# Altium project SolderingStation_V4.PrjPcb
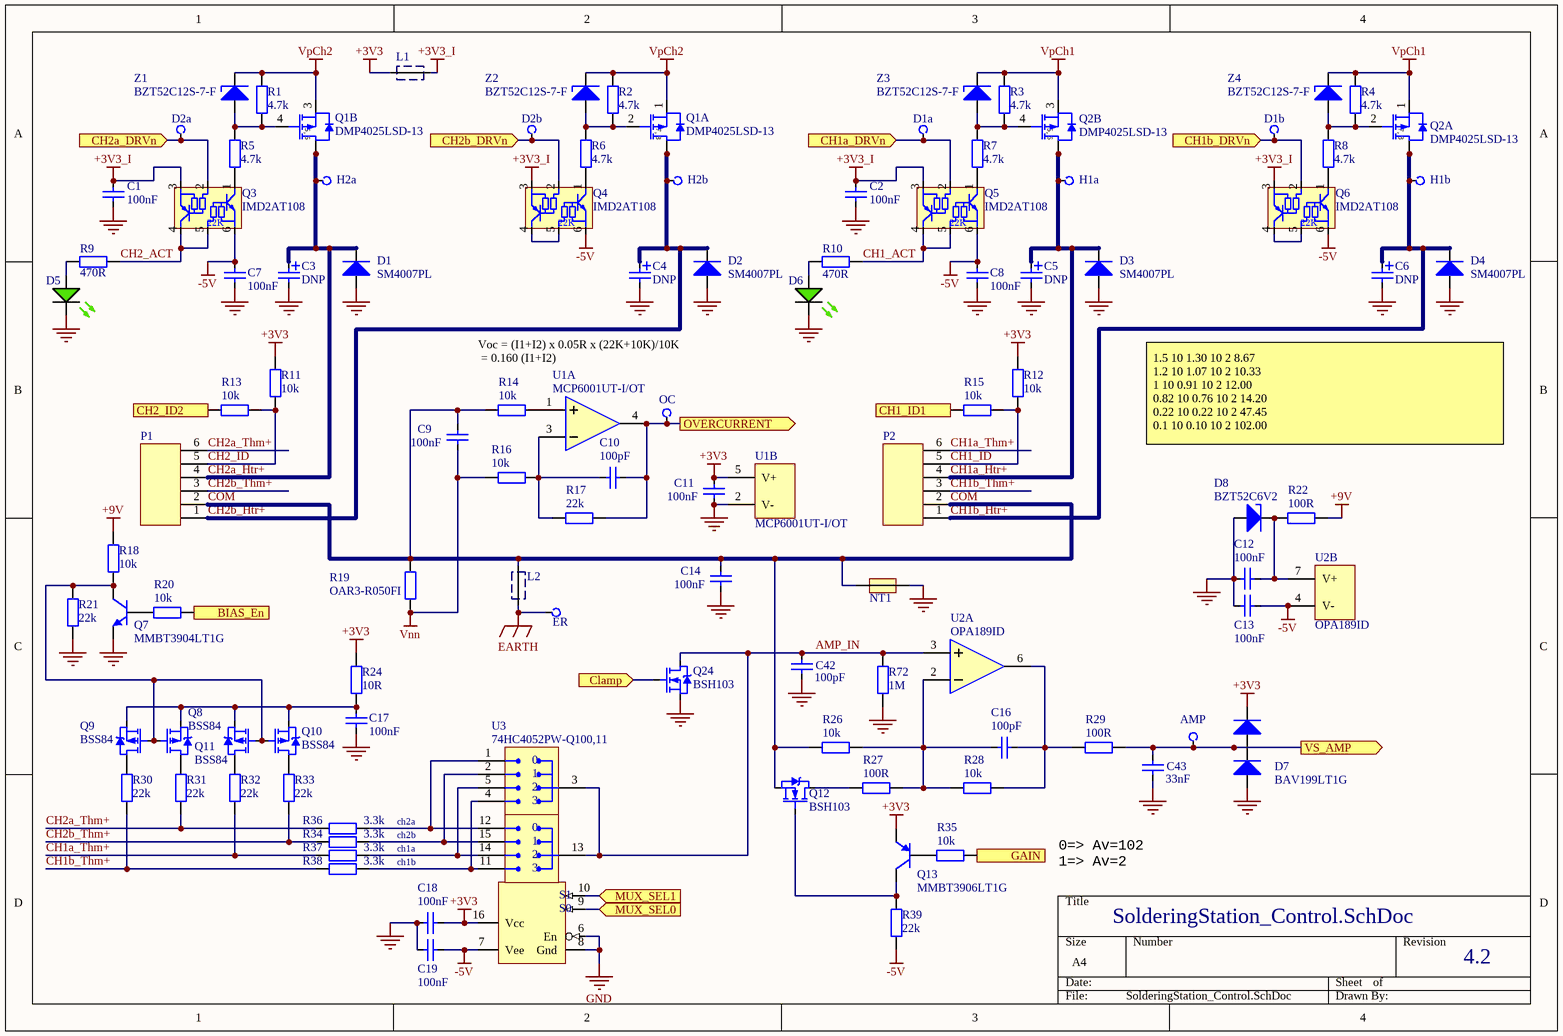
[diagram p0: SolderingStation_Control.SchDoc]
Version: 4.2
3 sheets, 227 parts. Net scope: flat (ports and power ports of the same name join across sheets).
Board file: SolderingStation.PcbDoc
Sheets:
  SolderingStation_Control.SchDoc
  SolderingStation_Power.SchDoc
  SolderingStation_Processor.SchDoc

## Sheet SolderingStation_Control.SchDoc
size A4

### Parts
AMP  NTC1  [PCBPIN - 0.9mm]  (value not drawn)  (no BOM)
C1  100nF  [CCNP1608-0603_N]
C2  100nF  [CCNP1608-0603_N]
C3  DNP  [CC2012-0805]  (no BOM)
C4  DNP  [CC2012-0805]  (no BOM)
C5  DNP  [CC2012-0805]  (no BOM)
C6  DNP  [CC2012-0805]  (no BOM)
C7  100nF  [CCNP1608-0603_N]
C8  100nF  [CCNP1608-0603_N]
C9  100nF  [CCNP1608-0603_N]
C10  100pF  [CCNP1608-0603_N]
C11  100nF  [CCNP1608-0603_N]
C12  100nF  [CCNP1608-0603_N]
C13  100nF  [CCNP1608-0603_N]
C14  100nF  [CCNP1608-0603_N]
C16  100pF  [CCNP1608-0603_N]
C17  100nF  [CCNP1608-0603_N]
C18  100nF  [CCNP1608-0603_N]
C19  100nF  [CCNP1608-0603_N]
C42  100pF  [CCNP1608-0603_N]
C43  33nF  [CCNP1608-0603_N]
D1  SM4007PL  [SOD-123FL]
D1a  Drive1  [PCBPIN - 0.9mm]  (value not drawn)  (no BOM)
D1b  Drive2  [PCBPIN - 0.9mm]  (value not drawn)  (no BOM)
D2  SM4007PL  [SOD-123FL]
D2a  Drive2  [PCBPIN - 0.9mm]  (value not drawn)  (no BOM)
D2b  Drive2  [PCBPIN - 0.9mm]  (value not drawn)  (no BOM)
D3  SM4007PL  [SOD-123FL]
D4  SM4007PL  [SOD-123FL]
D5  LED  [LED3MM-GREEN - 10mm Proud]  (value not drawn)
D6  LED  [LED3MM-GREEN - 10mm Proud]  (value not drawn)
D7  BAV199LT1G  [SOT23_N]
D8  BZT52C6V2  [SOD-123]
ER  Gnd  [PCBPIN - 0.9mm]  (value not drawn)  (no BOM)
H1a  Heater1  [PCBPIN - 0.9mm]  (value not drawn)  (no BOM)
H1b  Heater2  [PCBPIN - 0.9mm]  (value not drawn)  (no BOM)
H2a  Heater2  [PCBPIN - 0.9mm]  (value not drawn)  (no BOM)
H2b  Heater2  [PCBPIN - 0.9mm]  (value not drawn)  (no BOM)
L1  Ferrite Bead 600R@100MHz  [FB2012-0805]  (value not drawn)
L2  Ferrite Bead 600R@100MHz  [FB2012-0805]  (value not drawn)
NT1  NetTieVia  [NetTieVia]  (value not drawn)  (net tie, no BOM)
OC  Overcurrent  [PCBPIN - 0.9mm]  (value not drawn)  (no BOM)
P1  MOLEX-43045-0612  [MOLEX-43045-0612]  (value not drawn)
P2  MOLEX-43045-0612  [MOLEX-43045-0612]  (value not drawn)
Q1  DMP4025LSD-13  [SO-8_M]  (parts A,B of 2)
Q2  DMP4025LSD-13  [SO-8_M]  (parts A,B of 2)
Q3  IMD2AT108  [SOT457_M - MIRROR]
Q4  IMD2AT108  [SOT457_M - MIRROR]
Q5  IMD2AT108  [SOT457_M - MIRROR]
Q6  IMD2AT108  [SOT457_M - MIRROR]
Q7  MMBT3904LT1G  [SOT23_N]
Q8  BSS84  [SOT23_M]
Q9  BSS84  [SOT23_M]
Q10  BSS84  [SOT23_M]
Q11  BSS84  [SOT23_M]
Q12  BSH103  [SOT23_N]
Q13  MMBT3906LT1G  [SOT23_N]
Q24  BSH103  [SOT23_N]
R1  4.7k  [CR1608-0603_N]
R2  4.7k  [CR1608-0603_N]
R3  4.7k  [CR1608-0603_N]
R4  4.7k  [CR1608-0603_N]
R5  4.7k  [CR1608-0603_N]
R6  4.7k  [CR1608-0603_N]
R7  4.7k  [CR1608-0603_N]
R8  4.7k  [CR1608-0603_N]
R9  470R  [CR1608-0603_N]
R10  470R  [CR1608-0603_N]
R11  10k  [CR1608-0603_N]
R12  10k  [CR1608-0603_N]
R13  10k  [CR1608-0603_N]
R14  10k  [CR1608-0603_N]
R15  10k  [CR1608-0603_N]
R16  10k  [CR1608-0603_N]
R17  22k  [CR1608-0603_N]
R18  10k  [CR1608-0603_N]
R19  OAR3-R050FI  [OAR3-R050FI]
R20  10k  [CR1608-0603_N]
R21  22k  [CR1608-0603_N]
R22  100R  [CR1608-0603_N]
R24  10R  [CR1608-0603_N]
R26  10k  [CR1608-0603_N]
R27  100R  [CR1608-0603_N]
R28  10k  [CR1608-0603_N]
R29  100R  [CR1608-0603_N]
R30  22k  [CR1608-0603_N]
R31  22k  [CR1608-0603_N]
R32  22k  [CR1608-0603_N]
R33  22k  [CR1608-0603_N]
R34  3.3k  [CR1608-0603_N]
R35  10k  [CR1608-0603_N]
R36  3.3k  [CR1608-0603_N]
R37  3.3k  [CR1608-0603_N]
R38  3.3k  [CR1608-0603_N]
R39  22k  [CR1608-0603_N]
R72  1M  [CR1608-0603_N]
U1  MCP6001UT-I/OT  [SOT23-5_M]  (parts A,B of 2)
U2  OPA189ID  [SOIC127P600-8N]  (parts A,B of 2)
U3  74HC4052PW-Q100,11  [TSSOP16_M]
Z1  BZT52C12S-7-F  [SOD-323]
Z2  BZT52C12S-7-F  [SOD-323]
Z3  BZT52C12S-7-F  [SOD-323]
Z4  BZT52C12S-7-F  [SOD-323]

### Ports
BIAS_En (in), CH1_ID1 (out), CH1a_DRVn (in), CH1b_DRVn (in), CH2_ID2 (out), CH2a_DRVn (in), CH2b_DRVn (in), Clamp (in), GAIN (in), MUX_SEL0 (in), MUX_SEL1 (in), OVERCURRENT (out), VS_AMP (out)

### Nets
+3V3: C11.1 C18.1 D7.2(A2) L1.1 Q13.2(E) R11.2 R12.2 R24.1 U1.5(V+) U3.16(Vcc)
+3V3_I: C1.1 C2.1 L1.2 Q3.3(E2) Q4.3(E2) Q5.3(E2) Q6.3(E2)
+9V: R18.1 R22.1
-5V: C7.1 C8.1 C13.1 C19.1 Q3.6(E1) Q4.6(E1) Q5.6(E1) Q6.6(E1) R39.1 U2.4(V-) U3.7(Vee)
EARTH: ER.1(TP) L2.1
GND: C1.2 C2.2 C3.2 C4.2 C5.2 C6.2 C7.2 C8.2 C11.2 C12.2 C13.2 C14.2 C17.1 C18.2 C19.2 C42.1 C43.1 D1.A D2.A D3.A D4.A D5.K D6.K D7.1(A1) D8.A NT1.1 Q7.2(E) Q24.2(S) R21.1 R72.1 U1.2(V-) U3.6(En) U3.8(Gnd)
Vnn: C9.2 R16.2 R19.1
VpCh1: Q2.1(S1) Q2.3(S2) R3.2 R4.2 Z3.K Z4.K
VpCh2: Q1.1(S1) Q1.3(S2) R1.2 R2.2 Z1.K Z2.K
AMP_IN: C42.2 Q24.3(D) R72.2 U2.3(+IN) U3.3(2Z) U3.13(1Z)
BIAS_En: R20.2 ; port BIAS_En
CH1_ACT: Q5.4(C2) Q5.5(B1) R10.2
CH1_ID: P2.5 R12.1 R15.1
CH1_ID1: R15.2 ; port CH1_ID1
CH1a_DRVn: D1a.1(TP) Q5.2(B2) ; port CH1a_DRVn
CH1a_Htr+: C5.1 D3.K H1a.1(TP) P2.4 Q2.5(D2) Q2.6(D2)
CH1a_Thm+: P2.6 R32.1 R37.2
CH1b_DRVn: D1b.1(TP) Q6.2(B2) ; port CH1b_DRVn
CH1b_Htr+: C6.1 D4.K H1b.1(TP) P2.1 Q2.7(D1) Q2.8(D1)
CH1b_Thm+: P2.3 R30.1 R38.2
CH2_ACT: Q3.4(C2) Q3.5(B1) R9.2
CH2_ID: P1.5 R11.1 R13.1
CH2_ID2: R13.2 ; port CH2_ID2
CH2a_DRVn: D2a.1(TP) Q3.2(B2) ; port CH2a_DRVn
CH2a_Htr+: C3.1 D1.K H2a.1(TP) P1.4 Q1.5(D2) Q1.6(D2)
CH2a_Thm+: P1.6 R31.1 R36.2
CH2b_DRVn: D2b.1(TP) Q4.2(B2) ; port CH2b_DRVn
CH2b_Htr+: C4.1 D2.K H2b.1(TP) P1.1 Q1.7(D1) Q1.8(D1)
CH2b_Thm+: P1.3 R33.1 R34.2
Clamp: Q24.1(G) ; port Clamp
COM: C9.1 C14.1 L2.2 NT1.2 P1.2 P2.2 Q12.2(S) R14.2 R19.2 R26.1
GAIN: R35.2 ; port GAIN
MUX_SEL0: U3.9(S1) ; port MUX_SEL0
MUX_SEL1: U3.10(S0) ; port MUX_SEL1
OVERCURRENT: C10.2 OC.1(TP) R17.2 U1.4(Out) ; port OVERCURRENT
VS_AMP: AMP.1(TP) C43.2 D7.3(K) R29.1 ; port VS_AMP
NetC10_1: C10.1 R16.1 R17.1 U1.3(In-)
NetC12_1: C12.1 D8.K R22.2 U2.7(V+)
NetC16_1: C16.1 R26.2 R27.1 R28.1 U2.2(-IN)
NetC16_2: C16.2 R28.2 R29.2 U2.6(OUT)
NetC17_2: C17.2 Q8.2(S) Q9.2(S) Q10.2(S) Q11.2(S) R24.2
NetD5_A: D5.A R9.1
NetD6_A: D6.A R10.1
NetQ1_2: Q1.2(G1) R2.1 R6.2 Z2.A
NetQ1_4: Q1.4(G2) R1.1 R5.2 Z1.A
NetQ2_2: Q2.2(G1) R4.1 R8.2 Z4.A
NetQ2_4: Q2.4(G2) R3.1 R7.2 Z3.A
NetQ3_1: Q3.1(C1) R5.1
NetQ4_1: Q4.1(C1) R6.1
NetQ4_4: Q4.4(C2) Q4.5(B1)
NetQ5_1: Q5.1(C1) R7.1
NetQ6_1: Q6.1(C1) R8.1
NetQ6_4: Q6.4(C2) Q6.5(B1)
NetQ7_1: Q7.1(B) R20.1
NetQ7_3: Q7.3(C) Q8.1(G) Q9.1(G) Q10.1(G) Q11.1(G) R18.2 R21.2
NetQ8_3: Q8.3(D) R32.2
NetQ9_3: Q9.3(D) R30.2
NetQ10_3: Q10.3(D) R33.2
NetQ11_3: Q11.3(D) R31.2
NetQ12_1: Q12.1(G) Q13.3(C) R39.2
NetQ12_3: Q12.3(D) R27.2
NetQ13_1: Q13.1(B) R35.1
NetR14_1: R14.1 U1.1(In+)
NetR34_1: R34.1 U3.2(2Y2) U3.15(1Y2)
NetR36_1: R36.1 U3.1(2Y0) U3.12(1Y0)
NetR37_1: R37.1 U3.5(2Y1) U3.14(1Y1)
NetR38_1: R38.1 U3.4(2Y3) U3.11(1Y3)

### Notes on the sheet
- Voc = (I1+I2) x 0.05R x (22K+10K)/10K
  = 0.160 (I1+I2)
- 1.5	10	1.30	10	2	8.67
  1.2	10	1.07	10	2	10.33
  1	10	0.91	10	2	12.00
  0.82	10	0.76	10	2	14.20
  0.22	10	0.22	10	2	47.45
  0.1	10	0.10	10	2	102.00
- ch1a
- ch2a
- ch2b
- ch1b
- 0=> Av=102
  1=> Av=2
- (in symbol 74HC4052PW-Q100,11) 0
- (in symbol DMP4025LSD-13, part A) 7, 8
- (in symbol DMP4025LSD-13, part B) 5, 6
- (in symbol IMD2AT108) 22K

### Library data of the parts
AMP D1a D1b D2a D2b ER H1a H1b H2a H2b OC = TP: Test Point; Digikey: *; Farnell PN: *; LCSC: *
C1 C2 C7-C9 C11-C14 C17-C19 = Cap_CCNP_0603_100nF: Capacitor non-polar SMT 0603; Manufacturer: Generic Components; Class: Passive; Published: 08/06/2000; Publisher: Altium Hobart Technology Centre; SubClass: Capacitor; Farnell PN: *; Digikey: *; Value: 100nF; LCSC: C14663
C3-C6 = Cap_CC_0805: Capacitor SMT 0805; Manufacturer: Generic Components; Class: Passive; Published: 08/06/2000; Publisher: Altium Hobart Technology Centre; SubClass: Capacitor; Farnell PN: *; Digikey: *; Value: DNP
C10 C16 C42 C43 = Cap_CCNP_0603_100pF: Capacitor non-polar SMT 0603; Manufacturer: Generic Components; Class: Passive; Published: 08/06/2000; Publisher: Altium Hobart Technology Centre; SubClass: Capacitor; Farnell PN: *; Digikey: *
  C10 C16 C42: Value: 100pF; LCSC: C14858
  C43: Value: 33nF; LCSC: C21117
D1-D4 = SM4007PL: Diodes - General Purpose, 1kV 1A 1.1V 1A SOD-123FL; Class: Discrete; SubClass: Diode - Switching; Digikey: *; Farnell PN: *; LCSC: C64898
D5 D6 = LED_3MM_GREEN: 3mm Green LED; Manufacturer: Generic Components; Class I: Optoelectronic; Published: 8-Jun-2000; Revision: July-2002: Re-released for DXP Platform.; Publisher: Altium Limited; Class II: LED; Digikey: *; Farnell PN: *; LCSC: *
D7 = BAV199LT1G: Diode - Dual Series low-leakage switching, SOT-23; Digikey: BAV199LT1GOSCT-ND; Farnell PN: 1431115; LCSC: C145516
D8 = BZT52C6V2: Zener Single Diode, 6.2 V, 500 mW, SOD-123, 6 %, 2 Pins, 150 °C; Manufacturer: DiodesIncorporated; Unit Weight: 0.000353oz; Zz - Zener Impedance: 60Ohms; Vz - Zener Voltage: 5.1V; Pd - Power Dissipation: 500mW; Zener Current: 5mA; Ir - Reverse Current: 2uA; Voltage Temperature Coefficient: -0.75mV/C; Voltage Tolerance: 6%; Height: 1.35mm; Width: 1.7mm; Minimum Operating Temperature: -65C; Series: BZT52C5; Package Description: 2-Pin Surface Mount Device, Body 2.7 x 1.55 mm; Length: 2.85mm; Mounting Technology: SurfaceMount; Brand: DiodesIncorporated; Factory Pack Quantity: 3000; Product Category: ZenerDiodes; RoHS: True; Manufacturer URL: http://www.diodes.com/; Termination Style: SMD/SMT; Package / Case: SOD-123; Packaging: Reel; Package Reference: SOD123; Datasheet Version: Rev. 37-2, 09/2012; Maximum Operating Temperature: +150C; Datasheet URL: http://www.diodes.com/_files/datasheets/ds18004.pdf; Configuration: Single; Mounting Style: SMD/SMT
L1 L2 = Ferrite Bead 0805 600R: Ferrite Bead 600Ω @ 100MHz 1 500mA 300mΩ 0805; Farnell PN: *; Digikey: *; LCSC: C1017
P1 P2 = MOLEX-43045-0612: Wire-To-Board Connector, With Polarizing Peg, 3 mm, 6 Contacts, Header, Micro-Fit 3.0 43045 Series; Farnell PN: 1012248
Q1 Q2 = DMP4025LSD-13: P-Channel dual MOSFET, 40 V, 7.6 A, 0.018 ohm, SOIC, Surface Mount; Farnell: 2543521
Q3-Q6 = IMD2AT108: Pre-Biased NPN and PNP pair, 50 V, 100 mA, 22 kohm, 22 kohm; LCSC: C509889; Farnell PN: 1680329
Q7 = MMBT3904LT1G: General Purpose Transistor, NPN Silicon, 3-Pin SOT-23, Pb-Free, Tape and Reel; Manufacturer: On Semiconductor; IC Continuous (A): 0.2; fT Min (MHz): 300; ComponentLink2Description: Datasheet; Polarity: NPN; PackageDescription: 3-Pin Small Outline Transistor, Body 2.92 x 1.3 mm, Pitch 0.95 mm; ComponentLink2URL: http://www.onsemi.cn/pub_link/Collateral/MMBT3904LT1-D.PDF; DatasheetVersion: Rev. 12; Mounting Technology: Surface Mount; PartNumber: MMBT3904LT1G; ComponentLink1URL: http://www.onsemi.com/; ComponentLink3Description: Package Specification; ComponentLink1Description: Manufacturer URL; PackageVersion: Rev. AP, 11/2009; PackageReference: SOT-23-3-318-08; Packing: Tape and Reel; ComponentLink3URL: http://www.onsemi.cn/pub_link/Collateral/318-08.PDF; RoHS: TRUE; LCSC: C20526
Q8-Q11 = BSS84: P-Channel Enhancement Mode FET -0.13 A, -50 V,  RDS(ON) = 10R at VGS = -5 V; Digikey: *; Farnell PN: *; LCSC: C8492
Q12 Q24 = BSH103: N-channel enhancement mode FET, , 30 V, 850 mA, 0.4 ohm, SOT23; PackageDescription: SOT-23; 3 Leads; Body 3.1 x 2.5 mm, inc. leads (LxW max), Alternate Lead Configuration; ComponentLink1Description: Manufacturer Link; ComponentLink1URL: http://www.zetex.com/; ComponentLink2Description: Datasheet; ComponentLink2URL: www.zetex.com/3.0/pdf/BSS138.pdf; Farnell PN: 1081307; Digikey: *; LCSC: C88711
Q13 = MMBT3906LT1G: General Purpose Transistor, PNP Silicon, 3-Pin SOT-23, Pb-Free, Tape and Reel; Manufacturer: On Semiconductor; IC Continuous (A): -0.2; fT Min (MHz): 250; PackageDescription: 3-Pin Small Outline Transistor, Body 2.92 x 1.3 mm, Pitch 0.95 mm; PartNumber: MMBT3906LT1G; Packing: Tape and Reel; ComponentLink3Description: Package Specification; Mounting Technology: Surface Mount; ComponentLink3URL: http://www.onsemi.cn/pub_link/Collateral/318-08.PDF; ComponentLink1URL: http://www.onsemi.com/; ComponentLink2URL: http://www.onsemi.cn/pub_link/Collateral/MMBT3906LT1-D.PDF; PackageReference: SOT-23-3-318-08; Polarity: PNP; ComponentLink2Description: Datasheet; PackageVersion: Rev. AP, 11/2009; RoHS: TRUE; DatasheetVersion: Rev. 11; ComponentLink1Description: Manufacturer URL; LCSC: C53444
R1-R8 = Res_CR0603_4k7: Resistor SMT 0603; Manufacturer: Generic Components; Class: Passive; Published: 08/06/2000; Publisher: Altium Hobart Technology Centre; SubClass: Resistor; Farnell PN: *; Digikey: *; LCSC: C23162; Value: 4.7k
R9 R10 = Res_CR0603_470R: Resistor SMT 0603; Manufacturer: Generic Components; Class: Passive; Published: 08/06/2000; Publisher: Altium Hobart Technology Centre; SubClass: Resistor; Farnell PN: *; Digikey: *; Value: 470R; LCSC: C23179
R11-R16 R18 R20 R26 R28 R35 = Res_CR0603_10k: Resistor SMT 0603; Manufacturer: Generic Components; Class: Passive; Published: 08/06/2000; Publisher: Altium Hobart Technology Centre; SubClass: Resistor; Farnell PN: *; Digikey: *; LCSC: C25804; Value: 10k
R17 R21 R30-R33 R39 = Res_CR0603_22k: Resistor SMT 0603; Manufacturer: Generic Components; Class: Passive; Published: 08/06/2000; Publisher: Altium Hobart Technology Centre; SubClass: Resistor; Farnell PN: *; Digikey: *; LCSC: C31850; Value: 22k
R19 = OAR3-R050FI: Current Sense Resistor, 0.05 ohm, OAR Series, 3 W, Metal Strip, Radial Leaded, 1%
R22 R29 = Res_CR0603_0R: Resistor SMT 0603; Manufacturer: Generic Components; Class: Passive; Published: 08/06/2000; Publisher: Altium Hobart Technology Centre; SubClass: Resistor; Farnell PN: *; Digikey: *; LCSC: C22775; Value: 100R
R24 = Res_CR0603_10R: Resistor SMT 0603; Manufacturer: Generic Components; Class: Passive; Published: 08/06/2000; Publisher: Altium Hobart Technology Centre; SubClass: Resistor; Farnell PN: *; Digikey: *; Value: 10R; LCSC: C22859
R27 R34 R36-R38 = Res_CR0603_3k3: Resistor SMT 0603; Manufacturer: Generic Components; Class: Passive; Published: 08/06/2000; Publisher: Altium Hobart Technology Centre; SubClass: Resistor; Farnell PN: *; Digikey: *
  R27: LCSC: C22775; Value: 100R
  R34 R36-R38: LCSC: C22978; Value: 3.3k
R72 = Res_CR0603_1M: Resistor SMT 0603; Manufacturer: Generic Components; Class: Passive; Published: 08/06/2000; Publisher: Altium Hobart Technology Centre; SubClass: Resistor; Farnell PN: *; Digikey: *; LCSC: C22935; Value: 1M
U1 = MCP6001UT-I/OT: Op-Amp, Single supply R-R in/out; Digikey: *; Farnell PN: *; LCSC: C21403
U2 = OPA189ID: Op-Amp 14MHz, MUX-friendly, low-noise, Zero-Drift, RRO, CMOS precision
U3 = 74HC4052PW-Q100,11: Analog Multiplexer / Demultiplexer, 4:1, 2 Circuits, 225 ohm, 2V to 10V, TSSOP-16; Farnell PN: 2445305; LCSC: C547006
Z1-Z4 = BZT52C12S-7-F: Surface Mount Zener Diode, 12-13 V, -65 to 150 degC, SOD-123; LCSC: C124208
NT1 = NetTieVia: LCSC: *

## Sheet SolderingStation_Power.SchDoc
size A4
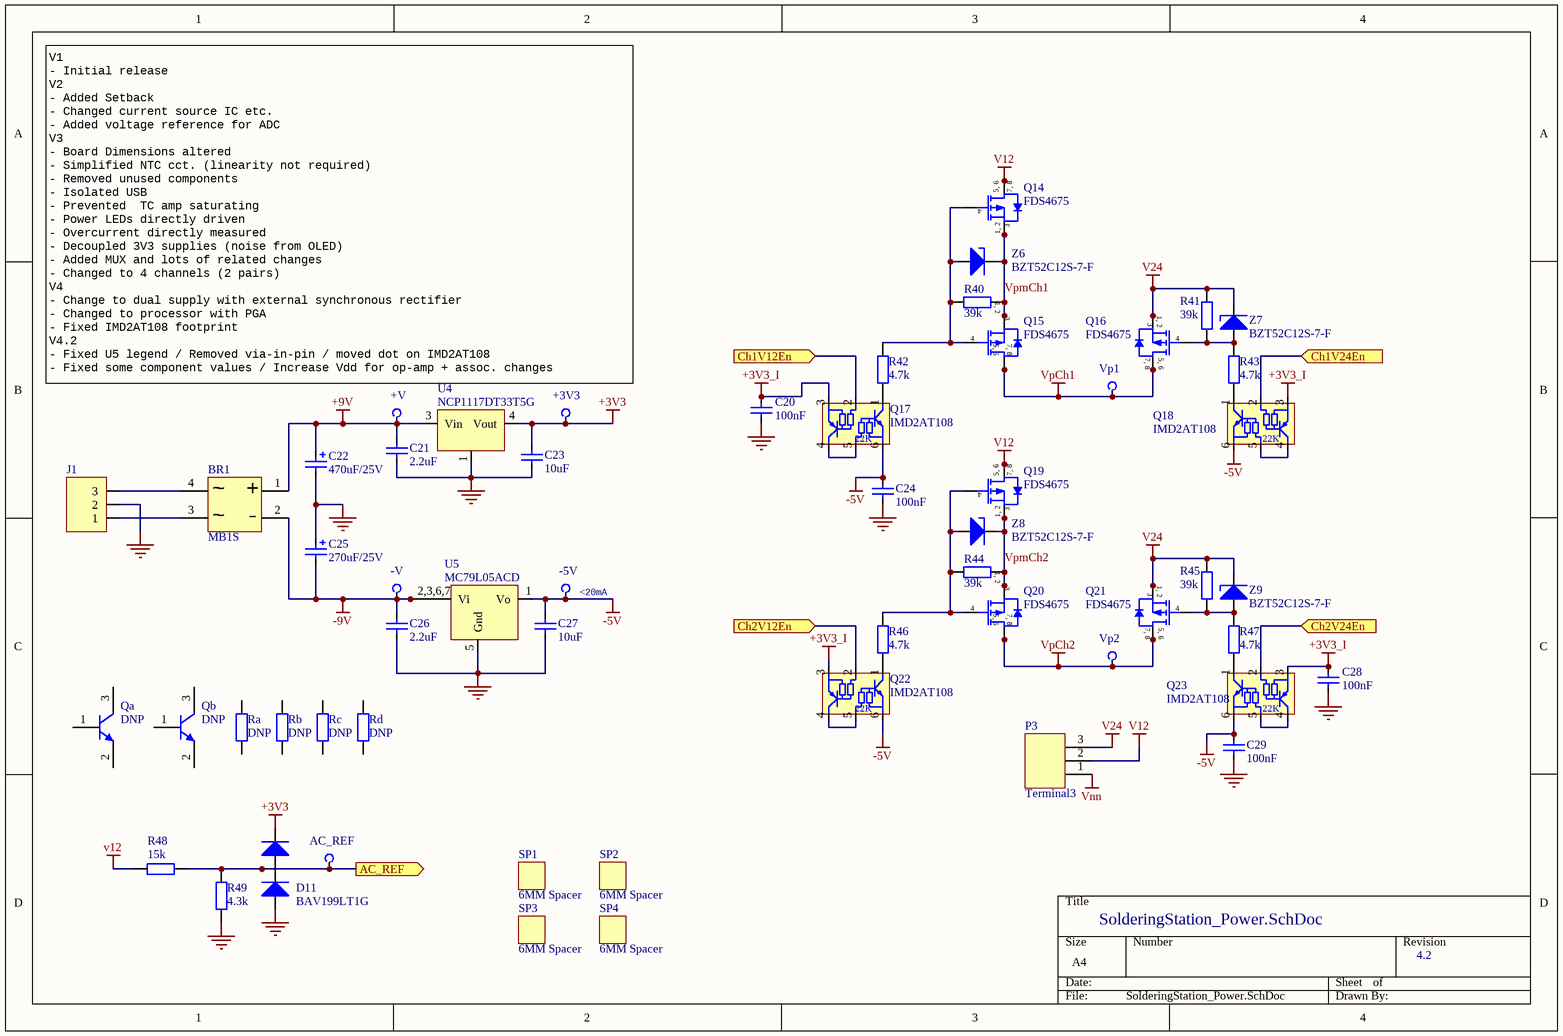
[diagram p1: SolderingStation_Power.SchDoc]

### Parts
+3V3  +3.3 volt  [PCBPIN - 0.9mm]  (value not drawn)  (no BOM)
+V  9 volt unregulated  [PCBPIN - 0.9mm]  (value not drawn)  (no BOM)
-5V  -5 volt  [PCBPIN - 0.9mm]  (value not drawn)  (no BOM)
-V  -9 volt unregulated  [PCBPIN - 0.9mm]  (value not drawn)  (no BOM)
AC_REF  Vdd  [PCBPIN - 0.9mm]  (value not drawn)  (no BOM)
BR1  MB1S  [MB1S]
C20  100nF  [CCNP1608-0603_N]
C21  2.2uF  [CCNP2012-0805]
C22  470uF/25V  [RB5/10x13mm]
C23  10uF  [CCNP2012-0805]
C24  100nF  [CCNP1608-0603_N]
C25  270uF/25V  [RB5/10x13mm]
C26  2.2uF  [CCNP2012-0805]
C27  10uF  [CCNP2012-0805]
C28  100nF  [CCNP1608-0603_N]
C29  100nF  [CCNP1608-0603_N]
D11  BAV199LT1G  [SOT23_M]
J1  JST XH Connector, 3-Pin  [jst-b3b-xh-ax]  (value not drawn)
P3  Terminal3  [MOLEX-39544-3003]
Q14  FDS4675  [SO-8_M]
Q15  FDS4675  [SO-8_M]
Q16  FDS4675  [SO-8_M]
Q17  IMD2AT108  [SOT457_M - MIRROR]
Q18  IMD2AT108  [SOT457_M - MIRROR]
Q19  FDS4675  [SO-8_M]
Q20  FDS4675  [SO-8_M]
Q21  FDS4675  [SO-8_M]
Q22  IMD2AT108  [SOT457_M - MIRROR]
Q23  IMD2AT108  [SOT457_M - MIRROR]
Qa  DNP  [SOT23_M]  (no BOM)
Qb  DNP  [SOT23_M]  (no BOM)
R40  39k  [CR1608-0603_N]
R41  39k  [CR1608-0603_N]
R42  4.7k  [CR1608-0603_N]
R43  4.7k  [CR1608-0603_N]
R44  39k  [CR1608-0603_N]
R45  39k  [CR1608-0603_N]
R46  4.7k  [CR1608-0603_N]
R47  4.7k  [CR1608-0603_N]
R48  15k  [CR1608-0603_N]
R49  4.3k  [CR1608-0603_N]
Ra  DNP  [CR1608-0603_N]  (no BOM)
Rb  DNP  [CR1608-0603_N]  (no BOM)
Rc  DNP  [CR1608-0603_N]  (no BOM)
Rd  DNP  [CR1608-0603_N]  (no BOM)
SP1  6MM Spacer  [Spacer-2mm dia x 6mm]
SP2  6MM Spacer  [Spacer-2mm dia x 6mm]
SP3  6MM Spacer  [Spacer-2mm dia x 6mm]
SP4  6MM Spacer  [Spacer-2mm dia x 6mm]
U4  NCP1117DT33T5G  [TO-252]
U5  MC79L05ACD  [SOIC127P600-8N]
Vp1  VpCH1  [PCBPIN - 0.9mm]  (value not drawn)  (no BOM)
Vp2  VpCh2  [PCBPIN - 0.9mm]  (value not drawn)  (no BOM)
Z6  BZT52C12S-7-F  [SOD-323]
Z7  BZT52C12S-7-F  [SOD-323]
Z8  BZT52C12S-7-F  [SOD-323]
Z9  BZT52C12S-7-F  [SOD-323]

### Ports
AC_REF (out), Ch1V12En (in), Ch1V24En (in), Ch2V12En (in), Ch2V24En (in)

### Nets
+3V3: +3V3.1(TP) C23.2 D11.2(A2) U4.4(Vout)
+3V3_I: C20.1 C28.1 Q17.3(E2) Q18.3(E2) Q22.3(E2) Q23.3(E2)
+9V: +V.1(TP) BR1.1 C21.2 C22.1 U4.3(Vin)
-5V: -5V.1(TP) C24.1 C27.2 C29.1 Q17.6(E1) Q18.6(E1) Q22.6(E1) Q23.6(E1) U5.1(Vo)
-9V: -V.1(TP) BR1.2 C25.2 C26.2 U5.2(Vi) U5.3(Vi) U5.6(Vi) U5.7(Vi)
GND: C20.2 C21.1 C22.2 C23.1 C24.2 C25.1 C26.1 C27.1 C28.2 C29.2 D11.1(A1) J1.2 R49.1 U4.1(Gnd) U5.5(Gnd)
v12: P3.2 Q14.5(D) Q14.6(D) Q14.7(D) Q14.8(D) Q19.5(D) Q19.6(D) Q19.7(D) Q19.8(D) R48.1
V24: P3.3 Q16.1(S) Q16.2(S) Q16.3(S) Q21.1(S) Q21.2(S) Q21.3(S) R41.2 R45.2 Z7.K Z9.K
Vnn: P3.1
VpCh1: Q15.5(D) Q15.6(D) Q15.7(D) Q15.8(D) Q16.5(D) Q16.6(D) Q16.7(D) Q16.8(D) Vp1.1(TP)
VpCh2: Q20.5(D) Q20.6(D) Q20.7(D) Q20.8(D) Q21.5(D) Q21.6(D) Q21.7(D) Q21.8(D) Vp2.1(TP)
AC_REF: AC_REF.1(TP) D11.3(K) R48.2 R49.2 ; port AC_REF
Ch1V12En: Q17.2(B2) ; port Ch1V12En
Ch1V24En: Q18.2(B2) ; port Ch1V24En
Ch2V12En: Q22.2(B2) ; port Ch2V12En
Ch2V24En: Q23.2(B2) ; port Ch2V24En
VpmCh1: Q14.1(S) Q14.2(S) Q14.3(S) Q15.1(S) Q15.2(S) Q15.3(S) R40.1 Z6.K
VpmCh2: Q19.1(S) Q19.2(S) Q19.3(S) Q20.1(S) Q20.2(S) Q20.3(S) R44.2 Z8.K
NetBR1_3: BR1.3 J1.1
NetBR1_4: BR1.4 J1.3
NetQ14_4: Q14.4(G) Q15.4(G) R40.2 R42.2 Z6.A
NetQ16_4: Q16.4(G) R41.1 R43.2 Z7.A
NetQ17_1: Q17.1(C1) R42.1
NetQ17_4: Q17.4(C2) Q17.5(B1)
NetQ18_1: Q18.1(C1) R43.1
NetQ18_4: Q18.4(C2) Q18.5(B1)
NetQ19_4: Q19.4(G) Q20.4(G) R44.1 R46.2 Z8.A
NetQ21_4: Q21.4(G) R45.1 R47.2 Z9.A
NetQ22_1: Q22.1(C1) R46.1
NetQ22_4: Q22.4(C2) Q22.5(B1)
NetQ23_1: Q23.1(C1) R47.1
NetQ23_4: Q23.4(C2) Q23.5(B1)

Not connected (* = marked no-connect by the designer): Qa 1(B) 2(E) 3(C); Qb 1(B) 2(E) 3(C); Ra 1 2; Rb 1 2; Rc 1 2; Rd 1 2; U5 4(NC) 8(NC)

### Notes on the sheet
- V1
  - Initial release
  V2
  - Added Setback
  - Changed current source IC etc.
  - Added voltage reference for ADC
  V3
  - Board Dimensions altered
  - Simplified NTC cct. (linearity not required)
  - Removed unused components
  - Isolated USB
  - Prevented  TC amp saturating
  - Power LEDs directly driven
  - Overcurrent directly measured
  - Decoupled 3V3 supplies (noise from OLED)
  - Added MUX and lots of related changes
  - Changed to 4 channels (2 pairs)
  V4
  - Change to dual supply with external synchronous rectifier
  - Changed to processor with PGA
  - Fixed IMD2AT108 footprint
  V4.2
  - Fixed U5 legend / Removed via-in-pin / moved dot on IMD2AT108
  - Fixed some component values / Increase Vdd for op-amp + assoc. changes
- (near -5V) <20mA
- (in symbol IMD2AT108) 22K
- (in symbol MB1S) ~; +; -
- (in symbol MC79L05ACD) 2,3,6,7

### Library data of the parts
+3V3 +V -5V -V AC_REF Vp1 Vp2 = TP: Test Point; Digikey: *; Farnell PN: *; LCSC: *
BR1 = MB1S: Bridge Rectifier Diode, Single Phase, 100 V, 800 mA, SOIC, 1.1 V, 4 Pins; LCSC: C232821
C20 C24 C28 C29 = Cap_CCNP_0603_100nF: as C1 on sheet SolderingStation_Control; Published: 08/06/2000; Publisher: Altium Hobart Technology Centre; SubClass: Capacitor; Farnell PN: *; Digikey: *; Value: 100nF; LCSC: C14663
C21 C26 = Cap_CCNP_0805_2u2F: Capacitor non-polar SMT 0805; Manufacturer: Generic Components; Class: Passive; Published: 08/06/2000; Publisher: Altium Hobart Technology Centre; SubClass: Capacitor; Farnell PN: *; Digikey: *; LCSC: C49217; Value: 2.2uF
C22 C25 = Cap-RB5/10x16MM
  C22: value: 470uF/25V
  C25: value: 270uF/25V
C23 C27 = Cap_CCNP_0805_10uF: Capacitor non-polar SMT 0805; Manufacturer: Generic Components; Class: Passive; Published: 08/06/2000; Publisher: Altium Hobart Technology Centre; SubClass: Capacitor; Farnell PN: *; Digikey: *; Value: 10uF; LCSC: C15850
D11 = BAV199LT1G: Dual Series low-leakage switching diodes, 3-Pin SOT-23; Digikey: BAV199LT1GOSCT-ND; Farnell PN: 1431115; LCSC: C145516
J1 = JST-B3B-XH-A: LatestRevisionDate: 17-Jul-2002; LatestRevisionNote: Re-released for DXP Platform.; Publisher: Altium Limited; LCSC: *; Farnell PN: 1516277; Digikey: 455-2248-ND
P3 = Terminal3: MULTICOMP MC24367 Wire-To-Board Terminal Block; Farnell PN: *; LCSC: *
Q14-Q16 Q19-Q21 = FDS4675: P-Channel Power MOSFET, 11 A, 40 V, RDS(ON) = 0.013 ohm @ VGS = -10   VRDS(ON) = 0.017 ohm @ VGS =   -4.5 VC; Manufacturer: Fairchild Semiconductor; Package Version: Rev. 16, 08/2015; Qg Gate Charge: 56nC; Drain-to-Source Voltage [Vdss]: 40V; Drain-Source On Resistance-Max: 13mO; Rated Power Dissipation: 2.4W; Datasheet Version: Rev. C(W), 02/2001; Package Description: 8-Pin Small Outline Integrated Circuit, Body 4.9 x 3.9 mm, Pitch 1.27 mm; Channel Type: P-Channel; Datasheet URL: https://www.fairchildsemi.com/datasheets/FD/FDS4675.pdf; Package URL: https://www.fairchildsemi.com/package-drawings/M0/M08A.pdf; Package Reference: SO-8; Mounting Technology: SurfaceMount; Manufacturer URL: https://www.fairchildsemi.com/; Temperature: 25
Q17 Q18 Q22 Q23 = IMD2AT108: as Q3 on sheet SolderingStation_Control; LCSC: C509889; Farnell PN: 1680329
Qa Qb = MMBT3904LT1G: SOT23; ComponentLink2Description: Datasheet; ComponentLink2URL: http://www.onsemi.cn/pub_link/Collateral/MMBT3904LT1-D.PDF; ComponentLink1URL: http://www.onsemi.com/; ComponentLink3Description: Package Specification; ComponentLink1Description: Manufacturer URL; ComponentLink3URL: http://www.onsemi.cn/pub_link/Collateral/318-08.PDF
R40 R41 R44 R45 = Res_CR0603_39k: Resistor SMT 0603; Manufacturer: Generic Components; Class: Passive; Published: 08/06/2000; Publisher: Altium Hobart Technology Centre; SubClass: Resistor; Farnell PN: *; Digikey: *; LCSC: C23153; Value: 39k
R42 R43 R46 R47 = Res_CR0603_4k7: as R1 on sheet SolderingStation_Control; Published: 08/06/2000; Publisher: Altium Hobart Technology Centre; SubClass: Resistor; Farnell PN: *; Digikey: *; LCSC: C23162; Value: 4.7k
R48 = Res_CR0603_15k: Resistor SMT 0603; Manufacturer: Generic Components; Class: Passive; Published: 08/06/2000; Publisher: Altium Hobart Technology Centre; SubClass: Resistor; Farnell PN: *; Digikey: *; LCSC: C22809; Value: 15k
R49 = Res_CR0603_4k3: Resistor SMT 0603; Manufacturer: Generic Components; Class: Passive; Published: 08/06/2000; Publisher: Altium Hobart Technology Centre; SubClass: Resistor; Farnell PN: *; Digikey: *; LCSC: C23159; Value: 4.3k
Ra Rb Rc Rd = Res_CR0603: Resistor SMT 0603; Manufacturer: Generic Components; Class: Passive; Published: 08/06/2000; Publisher: Altium Hobart Technology Centre; SubClass: Resistor; Farnell PN: *; Digikey: *; Value: DNP
SP1-SP4 = Spacer-6mm
U4 = NCP1117DT33T5G: IC REG LINEAR +3V3 1A TO252-3; Farnel: 2464254; DigiKey: NCP1117DT33T5GOSCT-ND; LCSC: C152529
U5 = MC79L05ACD: IC REG LINEAR -5V 100MA SOIC-8; DigiKey: UA79M05CKVURG3; LCSC: C154823; Farnell PN: 3122804
Z6-Z9 = BZT52C12S-7-F: as Z1 on sheet SolderingStation_Control; LCSC: C124208

## Sheet SolderingStation_Processor.SchDoc
size A4
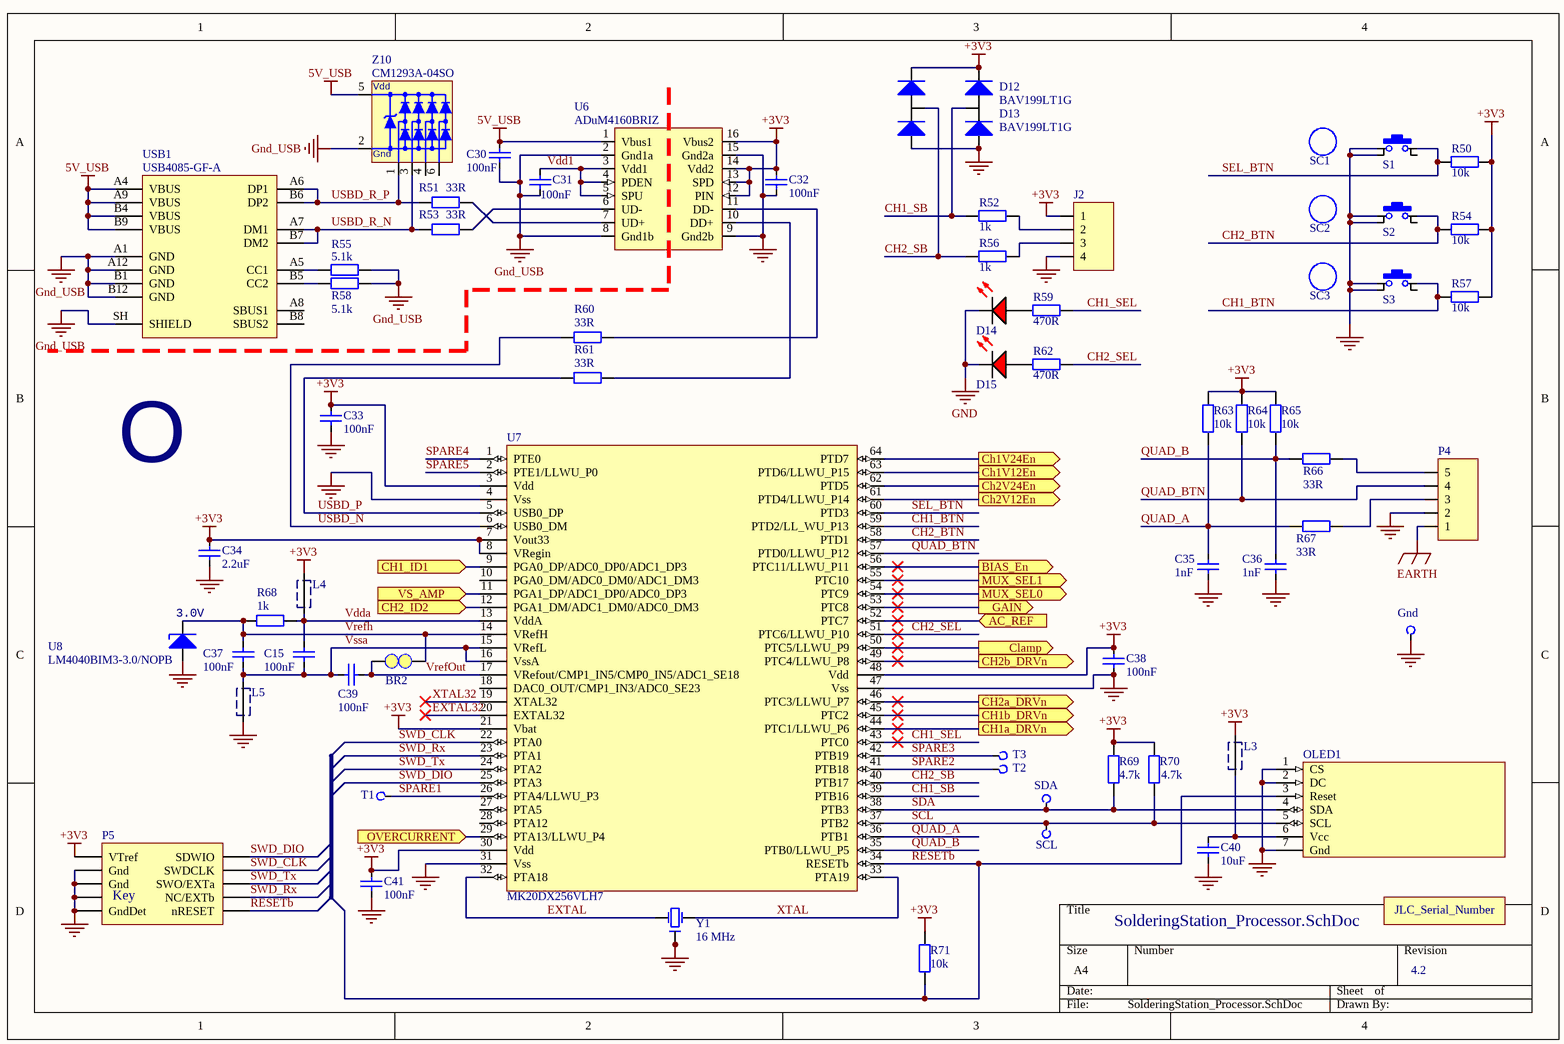
[diagram p2: SolderingStation_Processor.SchDoc]

### Parts
BR2  Solder Bridge (Open)  [SolderBridge(Open)]  (value not drawn)  (no BOM)
C15  100nF  [CCNP1608-0603_N]
C30  100nF  [CCNP1608-0603_N]
C31  100nF  [CCNP1608-0603_N]
C32  100nF  [CCNP1608-0603_N]
C33  100nF  [CCNP1608-0603_N]
C34  2.2uF  [CCNP1608-0603_N]
C35  1nF  [CCNP1608-0603_N]
C36  1nF  [CCNP1608-0603_N]
C37  100nF  [CCNP1608-0603_N]
C38  100nF  [CCNP1608-0603_N]
C39  100nF  [CCNP1608-0603_N]
C40  10uF  [CCNP2012-0805]
C41  100nF  [CCNP1608-0603_N]
D12  BAV199LT1G  [SOT23_M]
D13  BAV199LT1G  [SOT23_M]
D14  LED  [LED3MM-RED - 10mm Proud]  (value not drawn)
D15  LED  [LED3MM-RED - 10mm Proud]  (value not drawn)
Gnd  Gnd  [PCBPIN - 0.9mm]  (value not drawn)  (no BOM)
J2  JST XH Connector, 4-Pin  [jst-b4b-xh-ax]  (value not drawn)
JLC_Serial_Number1  JLC_Serial_Number  [JLC_Serial_Number]  (value not drawn)  (no BOM)
L3  Ferrite Bead 600R@100MHz  [FB2012-0805]  (value not drawn)
L4  Ferrite Bead 600R@100MHz  [FB1608-0603]  (value not drawn)
L5  Ferrite Bead 600R@100MHz  [FB1608-0603]  (value not drawn)
Logo1  OSHW Logo  [OSHW]  (value not drawn)  (no BOM)
OLED1  OLED_Display  [OLED_Display_128x64_2.4inch - no mounting holes]  (value not drawn)
P4  Header, 5-Pin  [HDR1X5S]  (value not drawn)
P5  SWD Connector 2x5-Pin  [SWD-2x5-Jig-Header]  (value not drawn)  (no BOM)
R50  10k  [CR1608-0603_N]
R51  33R  [CR1608-0603_N]
R52  1k  [CR1608-0603_N]
R53  33R  [CR1608-0603_N]
R54  10k  [CR1608-0603_N]
R55  5.1k  [CR1608-0603_N]
R56  1k  [CR1608-0603_N]
R57  10k  [CR1608-0603_N]
R58  5.1k  [CR1608-0603_N]
R59  470R  [CR1608-0603_N]
R60  33R  [CR1608-0603_N]
R61  33R  [CR1608-0603_N]
R62  470R  [CR1608-0603_N]
R63  10k  [CR1608-0603_N]
R64  10k  [CR1608-0603_N]
R65  10k  [CR1608-0603_N]
R66  33R  [CR1608-0603_N]
R67  33R  [CR1608-0603_N]
R68  1k  [CR1608-0603_N]
R69  4.7k  [CR1608-0603_N]
R70  4.7k  [CR1608-0603_N]
R71  10k  [CR1608-0603_N]
S1  SW_PB-B3F1052  [SW_MIN_PB-B3F1052]  (value not drawn)
S2  SW_PB-B3F1052  [SW_MIN_PB-B3F1052]  (value not drawn)
S3  SW_PB-B3F1052  [SW_MIN_PB-B3F1052]  (value not drawn)
SC1  B32-2010  [SW-CAP-B32-2010]  (value not drawn)
SC2  B32-2010  [SW-CAP-B32-2010]  (value not drawn)
SC3  B32-2010  [SW-CAP-B32-2010]  (value not drawn)
SCL  SCL  [PCBPIN - 0.9mm]  (value not drawn)  (no BOM)
SDA  SDA  [PCBPIN - 0.9mm]  (value not drawn)  (no BOM)
T1  PTA4  [PCBPIN - 0.9mm]  (value not drawn)  (no BOM)
T2  PTB18  [PCBPIN - 0.9mm]  (value not drawn)  (no BOM)
T3  PTB19  [PCBPIN - 0.9mm]  (value not drawn)  (no BOM)
U6  ADuM4160BRIZ  [SOIC127P1030-16M]
U7  MK20DX256VLH7  [TSQFP50P1200X1200-64M]
U8  LM4040BIM3-3.0/NOPB  [SOT23_M]
USB1  USB4085-GF-A  [USB4085-GF-A]
Y1  16 MHz  [Crystal_SMD_3.2x2.5]
Z10  CM1293A-04SO  [SOT457_M - 180]

### Ports
AC_REF (in), BIAS_En (out), CH1_ID1 (in), CH1a_DRVn (out), CH1b_DRVn (out), Ch1V12En (out), Ch1V24En (out), CH2_ID2 (in), CH2a_DRVn (out), CH2b_DRVn (out), Ch2V12En (out), Ch2V24En (out), Clamp (out), GAIN (out), MUX_SEL0 (out), MUX_SEL1 (out), OVERCURRENT (in), VS_AMP (in)

### Nets
5V_USB: C30.2 U6.1(Vbus1) USB1.A4(VBUS) USB1.A9(VBUS) USB1.B4(VBUS) USB1.B9(VBUS) Z10.5(Vp)
+3V3: C32.2 C33.2 C34.2 C38.2 C41.2 D12.2(A2) D13.2(A2) J2.1 L3.1 L4.2 P5.1(VTref) R50.2 R54.2 R57.2 R63.2 R64.2 R65.2 R69.2 R70.2 R71.2 U6.12(PIN) U6.13(SPD) U6.14(Vdd2) U6.16(Vbus2) U7.3(Vdd) U7.7(Vout33) U7.8(VRegin) U7.21(Vbat) U7.30(Vdd) U7.48(Vdd)
EARTH: P4.1
GND: C32.1 C33.1 C34.1 C35.1 C36.1 C38.1 C40.1 C41.1 D12.1(A1) D13.1(A1) D14.K D15.K Gnd.1(TP) J2.4 L5.1 OLED1.1(CS) OLED1.2(DC) OLED1.7(Gnd) P4.2 P5.0(Pins) P5.3(Gnd) P5.5(Gnd) P5.9(GndDet) S1.1 S1.1b S2.1 S2.1b S3.1 S3.1b U6.9(Gnd2b) U6.15(Gnd2a) U7.4(Vss) U7.31(Vss) U7.47(Vss) U8.2(A) Y1.2(Gnd) Y1.4(Gnd)
Gnd_USB: C30.1 C31.1 R55.2 R58.2 U6.2(Gnd1a) U6.8(Gnd1b) USB1.A1(GND) USB1.A12(GND) USB1.B1(GND) USB1.B12(GND) USB1.SH(SHIELD) Z10.2(Vn)
AC_REF: U7.52(PTC7) ; port AC_REF
BIAS_En: U7.56(PTC11/LLWU_P11) ; port BIAS_En
CH1_BTN: R57.1 S3.2 U7.59(PTD2/LL_WU_P13)
CH1_ID1: U7.9(PGA0_DP/ADC0_DP0/ADC1_DP3) ; port CH1_ID1
CH1_SB: D13.3(K) R52.1 U7.39(PTB16)
CH1_SEL: R59.1 U7.43(PTC0)
CH1a_DRVn: U7.44(PTC1/LLWU_P6) ; port CH1a_DRVn
CH1b_DRVn: U7.45(PTC2) ; port CH1b_DRVn
Ch1V12En: U7.63(PTD6/LLWU_P15) ; port Ch1V12En
Ch1V24En: U7.64(PTD7) ; port Ch1V24En
CH2_BTN: R54.1 S2.2 U7.58(PTD1)
CH2_ID2: U7.12(PGA1_DM/ADC1_DM0/ADC0_DM3) ; port CH2_ID2
CH2_SB: D12.3(K) R56.1 U7.40(PTB17)
CH2_SEL: R62.2 U7.51(PTC6/LLWU_P10)
CH2a_DRVn: U7.46(PTC3/LLWU_P7) ; port CH2a_DRVn
CH2b_DRVn: U7.49(PTC4/LLWU_P8) ; port CH2b_DRVn
Ch2V12En: U7.61(PTD4/LLWU_P14) ; port Ch2V12En
Ch2V24En: U7.62(PTD5) ; port Ch2V24En
Clamp: U7.50(PTC5/LLWU_P9) ; port Clamp
EXTAL: U7.32(PTA18) Y1.3(OSC2)
EXTAL32: U7.20(EXTAL32)
GAIN: U7.53(PTC8) ; port GAIN
MUX_SEL0: U7.54(PTC9) ; port MUX_SEL0
MUX_SEL1: U7.55(PTC10) ; port MUX_SEL1
OVERCURRENT: U7.29(PTA13/LLWU_P4) ; port OVERCURRENT
QUAD_A: C35.2 R63.1 R67.2 U7.36(PTB1)
QUAD_B: C36.2 R65.1 R66.2 U7.35(PTB0/LLWU_P5)
QUAD_BTN: P4.4 R64.1 U7.57(PTD0/LLWU_P12)
RESETb: OLED1.3(Reset) P5.10(nRESET) R71.1 U7.34(RESETb)
SCL: OLED1.5(SCL) R70.1 SCL.1(TP) U7.37(PTB2)
SDA: OLED1.4(SDA) R69.1 SDA.1(TP) U7.38(PTB3)
SEL_BTN: R50.1 S1.2 U7.60(PTD3)
SPARE1: T1.1(TP) U7.26(PTA4/LLWU_P3)
SPARE2: T2.1(TP) U7.41(PTB18)
SPARE3: T3.1(TP) U7.42(PTB19)
SPARE4: U7.1(PTE0)
SPARE5: U7.2(PTE1/LLWU_P0)
SWD_CLK: P5.4(SWDCLK) U7.22(PTA0)
SWD_DIO: P5.2(SDWIO) U7.25(PTA3)
SWD_Rx: P5.8(NC/EXTb) U7.23(PTA1)
SWD_Tx: P5.6(SWO/EXTa) U7.24(PTA2)
USBD_N: R60.2 U7.6(USB0_DM)
USBD_P: R61.2 U7.5(USB0_DP)
USBD_R_N: R53.2 USB1.A7(DM1) USB1.B7(DM2) Z10.3
USBD_R_P: R51.2 USB1.A6(DP1) USB1.B6(DP2) Z10.1
Vdd1: C31.2 U6.3(Vdd1) U6.4(PDEN) U6.5(SPU)
Vdda: C15.2 L4.1 R68.1 U7.13(VddA)
Vrefh: BR2.2 C37.2 R68.2 U7.14(VRefH) U8.1(K)
VrefOut: BR2.1 C39.2 U7.17(VRefout/CMP1_IN5/CMP0_IN5/ADC1_SE18)
VS_AMP: U7.11(PGA1_DP/ADC1_DP0/ADC0_DP3) ; port VS_AMP
Vssa: C15.1 C37.1 C39.1 L5.2 U7.15(VRefL) U7.16(VssA)
XTAL: U7.33(PTA19) Y1.1(OSC1)
XTAL32: U7.19(XTAL32)
NetC40_2: C40.2 L3.2 OLED1.6(Vcc)
NetD14_A: D14.A R59.2
NetD15_A: D15.A R62.1
NetJ2_2: J2.2 R52.2
NetJ2_3: J2.3 R56.2
NetP4_3: P4.3 R67.1
NetP4_5: P4.5 R66.1
NetR51_1: R51.1 U6.7(UD+)
NetR53_1: R53.1 U6.6(UD-)
NetR55_1: R55.1 USB1.A5(CC1)
NetR58_1: R58.1 USB1.B5(CC2)
NetR60_1: R60.1 U6.11(DD-)
NetR61_1: R61.1 U6.10(DD+)

Not connected (* = marked no-connect by the designer): S1 2b; S2 2b; S3 2b; U7 10(PGA0_DM/ADC0_DM0/ADC1_DM3) 18(DAC0_OUT/CMP1_IN3/ADC0_SE23) 27(PTA5) 28(PTA12); U8 3(NC); USB1 A8(SBUS1) B8(SBUS2); Z10 4 6

### Notes on the sheet
- (near U8) 3.0V
- (in symbol CM1293A-04SO) Vdd; Gnd
- (in symbol OSHW Logo) O
- (in symbol SWD2X5_JIG) Key

### Library data of the parts
BR2 = SolderBridge(Open): Solder bridge; Digikey: *; Farnell PN: *; LCSC: *
C15 C30-C33 C37-C39 C41 = Cap_CCNP_0603_100nF: as C1 on sheet SolderingStation_Control; Published: 08/06/2000; Publisher: Altium Hobart Technology Centre; SubClass: Capacitor; Farnell PN: *; Digikey: *; Value: 100nF; LCSC: C14663
C34 = Cap_CCNP_0603_2u2F: Capacitor non-polar SMT 0603; Manufacturer: Generic Components; Class: Passive; Published: 08/06/2000; Publisher: Altium Hobart Technology Centre; SubClass: Capacitor; Farnell PN: *; Digikey: *; Value: 2.2uF; LCSC: C23630
C35 C36 = Cap_CCNP_0603_1nF: Capacitor non-polar SMT 0603; Manufacturer: Generic Components; Class: Passive; Published: 08/06/2000; Publisher: Altium Hobart Technology Centre; SubClass: Capacitor; Farnell PN: *; Digikey: *; Value: 1nF; LCSC: C1588
C40 = Cap_CCNP_0805_10uF: as C23 on sheet SolderingStation_Power; Published: 08/06/2000; Publisher: Altium Hobart Technology Centre; SubClass: Capacitor; Farnell PN: *; Digikey: *; Value: 10uF; LCSC: C15850
D12 D13 = BAV199LT1G: as D11 on sheet SolderingStation_Power; Digikey: BAV199LT1GOSCT-ND; Farnell PN: 1431115; LCSC: C145516
D14 D15 = LED_3MM_RED: 3mm Red LED; Manufacturer: Generic Components; Class I: Optoelectronic; Published: 8-Jun-2000; Revision: July-2002: Re-released for DXP Platform.; Publisher: Altium Limited; Class II: LED; Digikey: *; Farnell PN: *; LCSC: *
Gnd SCL SDA T1-T3 = TP: Test Point; Digikey: *; Farnell PN: *; LCSC: *
J2 = JST-B4B-XH-A: LatestRevisionDate: 17-Jul-2002; LatestRevisionNote: Re-released for DXP Platform.; Publisher: Altium Limited; LCSC: *; Farnell PN: 1516278; Digikey: 455-2249-ND
L3 = Ferrite Bead 0805 600R: as L1 on sheet SolderingStation_Control; Farnell PN: *; Digikey: *; LCSC: C1017
L4 L5 = Ferrite Bead 0603 600R: Ferrite Bead 600Ω @ 100MHz 1 200mA 450mΩ 0603; Farnell PN: *; Digikey: *; LCSC: C1002
OLED1 = OLED_Display_128x64_2.4inch: OLED Display 128x64 pixels, 2.4inch; LCSC: *
P4 = Header 1x5: LatestRevisionDate: 17-Jul-2002; LatestRevisionNote: Re-released for DXP Platform.; Publisher: Altium Limited; LCSC: *
P5 = SWD2X5_JIG: LatestRevisionDate: 17-Jul-2002; LatestRevisionNote: Re-released for DXP Platform.; Publisher: Altium Limited; Farnell PN: 1865285; LCSC: *
R50 R54 R57 R63-R65 R71 = Res_CR0603_10k: as R11 on sheet SolderingStation_Control; Published: 08/06/2000; Publisher: Altium Hobart Technology Centre; SubClass: Resistor; Farnell PN: *; Digikey: *; Value: 10k; LCSC: C25804
R51 R53 R60 R61 R66 R67 = Res_CR0603_33R: Resistor SMT 0603; Manufacturer: Generic Components; Class: Passive; Published: 08/06/2000; Publisher: Altium Hobart Technology Centre; SubClass: Resistor; Farnell PN: *; Digikey: *; Value: 33R; LCSC: C23140
R52 R56 R68 = Res_CR0603_1k: Resistor SMT 0603; Manufacturer: Generic Components; Class: Passive; Published: 08/06/2000; Publisher: Altium Hobart Technology Centre; SubClass: Resistor; Farnell PN: *; Digikey: *; Value: 1k; LCSC: C21190
R55 R58 = Res_CR0603_5k1: Resistor SMT 0603; Manufacturer: Generic Components; Class: Passive; Published: 08/06/2000; Publisher: Altium Hobart Technology Centre; SubClass: Resistor; Farnell PN: *; Digikey: *; Value: 5.1k; LCSC: C23186
R59 R62 = Res_CR0603_470R: as R9 on sheet SolderingStation_Control; Published: 08/06/2000; Publisher: Altium Hobart Technology Centre; SubClass: Resistor; Farnell PN: *; Digikey: *; Value: 470R; LCSC: C23179
R69 R70 = Res_CR0603_4k7: as R1 on sheet SolderingStation_Control; Published: 08/06/2000; Publisher: Altium Hobart Technology Centre; SubClass: Resistor; Farnell PN: *; Digikey: *; Value: 4.7k; LCSC: C23162
S1-S3 = SW_PB-B3F1052: Switch miniature push-button; Manufacturer: Generic Components; Published: 24-Mar-1999; Revision: July-2002: Re-released for DXP Platform.; Publisher: Altium Limited; Farnell PN: 196094202; LCSC: *
SC1-SC3 = Switch-Cap - B32-2010: Switch Cap; Farnell PN: 2352313
U6 = ADuM4160BRIZ: Full/Low Speed 5 kV USB Digital Isolator; Farnell PN: 2061081
U7 = MK20DX256VLH7: Arm Cortex M4 / Applies to MK20DX64VLH7, MK20DX128VLH7, MK20DX256VLH7; LCSC: *
U8 = LM4040BIM3-2.5/NOPB: IC 2.5V VREF SHUNT 0.2% SOT23-3; Digikey: LM4040BIM3X-2.5/NOPBCT-ND; Farnell PN: 3124419; LCSC: C131939
USB1 = USB4085-GF-A: USB-C, USB 2.0 Receptacle Connector 16 Position Through Hole, Right Angle; Angle: 90; Part Number: USB4085-GF-A; Digikey Part Number: 2073-USB4085-GF-ACT-ND; Digikey Link: https://www.digikey.ee/product-detail/en/gct/USB4085-GF-A/2073-USB4085-GF-ACT-ND/9859733; Farnell PN: 2924867; Digikey: 2073-USB4085-GF-ACT-ND; LCSC: *
Y1 = Crystal 16MHz: Crystal SMD 3.2 x 2.5 x 0.7 mm; Manufacturer: Generic Components; Class: Oscillator; SubClass: Crystal Oscillator; Published: 08/06/2000; Publisher: Altium Hobart Technology Centre; Digikey: *; Farnell PN: *; LCSC: C13738
Z10 = CM1293A-04SO: Ultra low capacitance quadruple rail-to-rail ESD protection; Farnell PN: 2533258; Digikey: CM1293A-04SOOSCT-ND; LCSC: C393377

## Nets that join several sheets
+3V3: SolderingStation_Control (10 pins), SolderingStation_Power (+3V3.1 C23.2 D11.2 U4.4), SolderingStation_Processor (30 pins)
+3V3_I: SolderingStation_Control (7 pins), SolderingStation_Power (6 pins)
+9V: SolderingStation_Control (R18.1 R22.1), SolderingStation_Power (5 pins)
-5V: SolderingStation_Control (11 pins), SolderingStation_Power (9 pins)
EARTH: SolderingStation_Control (ER.1 L2.1), SolderingStation_Processor (P4.1)
GND: SolderingStation_Control (33 pins), SolderingStation_Power (15 pins), SolderingStation_Processor (37 pins)
Vnn: SolderingStation_Control (C9.2 R16.2 R19.1), SolderingStation_Power (P3.1)
VpCh1: SolderingStation_Control (6 pins), SolderingStation_Power (9 pins)
VpCh2: SolderingStation_Control (6 pins), SolderingStation_Power (9 pins)
AC_REF: SolderingStation_Power (AC_REF.1 D11.3 R48.2 R49.2), SolderingStation_Processor (U7.52)
BIAS_En: SolderingStation_Control (R20.2), SolderingStation_Processor (U7.56)
CH1_ID1: SolderingStation_Control (R15.2), SolderingStation_Processor (U7.9)
CH1a_DRVn: SolderingStation_Control (D1a.1 Q5.2), SolderingStation_Processor (U7.44)
CH1b_DRVn: SolderingStation_Control (D1b.1 Q6.2), SolderingStation_Processor (U7.45)
Ch1V12En: SolderingStation_Power (Q17.2), SolderingStation_Processor (U7.63)
Ch1V24En: SolderingStation_Power (Q18.2), SolderingStation_Processor (U7.64)
CH2_ID2: SolderingStation_Control (R13.2), SolderingStation_Processor (U7.12)
CH2a_DRVn: SolderingStation_Control (D2a.1 Q3.2), SolderingStation_Processor (U7.46)
CH2b_DRVn: SolderingStation_Control (D2b.1 Q4.2), SolderingStation_Processor (U7.49)
Ch2V12En: SolderingStation_Power (Q22.2), SolderingStation_Processor (U7.61)
Ch2V24En: SolderingStation_Power (Q23.2), SolderingStation_Processor (U7.62)
Clamp: SolderingStation_Control (Q24.1), SolderingStation_Processor (U7.50)
GAIN: SolderingStation_Control (R35.2), SolderingStation_Processor (U7.53)
MUX_SEL0: SolderingStation_Control (U3.9), SolderingStation_Processor (U7.54)
MUX_SEL1: SolderingStation_Control (U3.10), SolderingStation_Processor (U7.55)
OVERCURRENT: SolderingStation_Control (C10.2 OC.1 R17.2 U1.4), SolderingStation_Processor (U7.29)
VS_AMP: SolderingStation_Control (AMP.1 C43.2 D7.3 R29.1), SolderingStation_Processor (U7.11)